# Altium schematic sheet Flasher_2Ch_ISO_Astable.SchDoc
size A
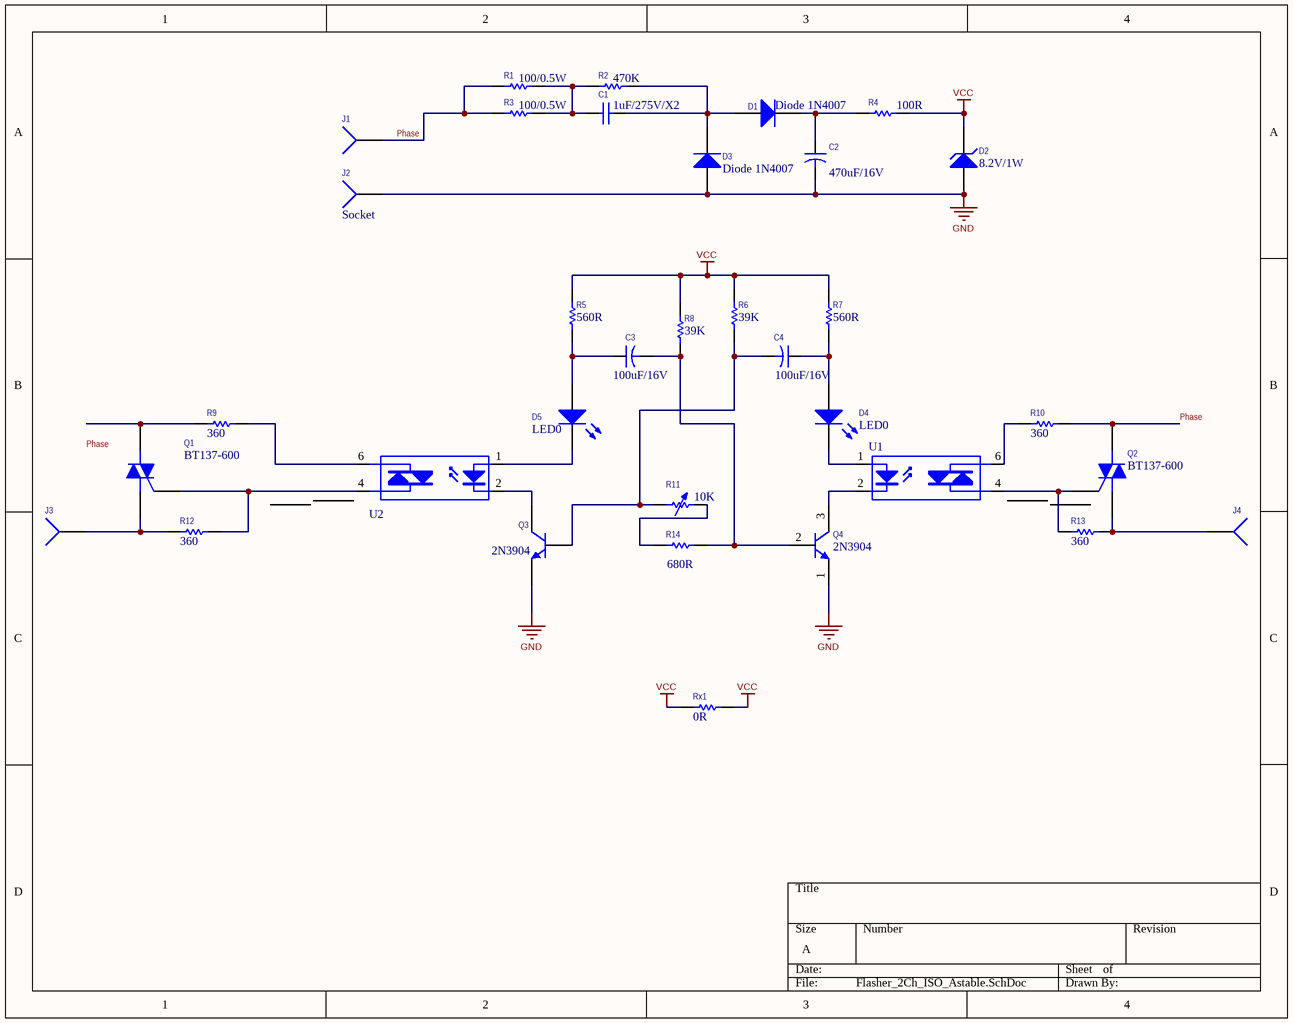
[diagram p0: Flasher_2Ch_ISO_Astable.SchDoc]

## Parts
C1  value 1uF/275V/X2  [Cap_polyester_275V_P22.5]  (hidden comment: Cap)
C2  value 470uF/16V  [Cap electrolitic radial 8x12-3.5]  (hidden comment: Cap2)
C3  value 100uF/16V  [Cap electrolitic radial 5x11-2]  (hidden comment: Cap2)
C4  value 100uF/16V  [Cap electrolitic radial 5x11-2]  (hidden comment: Cap2)
D1  Diode 1N4007  [DO-204AL]
D2  8.2V/1W  [DO-204AL]
D3  Diode 1N4007  [DO-204AL]
D4  LED0  [LED5MM_RED]
D5  LED0  [LED5MM_RED]
J1  Socket  [PIN1]  (value not drawn)
J2  Socket  [PIN1]
J3  Socket  [PIN1]  (value not drawn)
J4  Socket  [PIN1]  (value not drawn)
Q1  BT137-600  [TO-220 AB with heatsink ya25]
Q2  BT137-600  [TO-220 AB with heatsink ya25]
Q3  2N3904  [TO-92 STR]
Q4  2N3904  [TO-92 STR]
R1  value 100/0.5W  [Axial 0_5W 5_0mm]  (hidden comment: Res1)
R2  value 470K  [Axial 0_25 W, 0_4 IN LEAD PITCH]  (hidden comment: Res1)
R3  value 100/0.5W  [Axial 0_5W 5_0mm]  (hidden comment: Res1)
R4  value 100R  [Axial 0_25 W, 0_4 IN LEAD PITCH]  (hidden comment: Res1)
R5  value 560R  [Axial 0_25 W, 0_4 IN LEAD PITCH]  (hidden comment: Res1)
R6  value 39K  [Axial 0_25 W, 0_4 IN LEAD PITCH]  (hidden comment: Res1)
R7  value 560R  [Axial 0_25 W, 0_4 IN LEAD PITCH]  (hidden comment: Res1)
R8  value 39K  [Axial 0_25 W, 0_4 IN LEAD PITCH]  (hidden comment: Res1)
R9  value 360  [Axial 0_25 W, 0_4 IN LEAD PITCH]  (hidden comment: Res1)
R10  value 360  [Axial 0_25 W, 0_4 IN LEAD PITCH]  (hidden comment: Res1)
R11  value 10K  [AXIAL-0.4]  (hidden comment: Res Adj1)
R12  value 360  [Axial 0_25 W, 0_4 IN LEAD PITCH]  (hidden comment: Res1)
R13  value 360  [Axial 0_25 W, 0_4 IN LEAD PITCH]  (hidden comment: Res1)
R14  value 680R  [Axial 0_25 W, 0_4 IN LEAD PITCH]  (hidden comment: Res1)
Rx1  value 0R  [axial-0.3]  (hidden comment: Res1)
U1  MOC3063  [DIP-6]  (value not drawn)
U2  MOC3063  [DIP-6]  (value not drawn)

## Nets
GND: C2.2 D2.1(A) D3.1(A) J2.1 Q3.1(E) Q4.1(E)
VCC: D2.2(K) R4.1 R5.2 R6.2 R7.2 R8.2 Rx1.1 Rx1.2
Phase: J1.1 Q2.2(M2) R1.1 R3.1 R10.1
NetC1_1: C1.1 R1.2 R2.1 R3.2
NetC1_2: C1.2 D1.1(A) D3.2(K) R2.2
NetC2_1: C2.1 D1.2(K) R4.2
NetC3_1: C3.1 D5.1(A) R5.1
NetC3_2: C3.2 Q4.2(B) R8.1 R14.1
NetC4_1: C4.1 D4.1(A) R7.1
NetC4_2: C4.2 Q3.2(B) R6.1 R11.1
NetD4_2: D4.2(K) U1.1(A)
NetD5_2: D5.2(K) U2.1(A)
NetJ3_1: J3.1 Q1.1(M1) R12.2
NetJ4_1: J4.1 Q2.1(M1) R13.1
NetQ1_2: Q1.2(M2) R9.2
NetQ1_3: Q1.3(G) R12.1 U2.4(A/K)
NetQ2_3: Q2.3(G) R13.2 U1.4(A/K)
NetQ3_3: Q3.3(C) U2.2(K)
NetQ4_3: Q4.3(C) U1.2(K)
NetR9_1: R9.1 U2.6(A/K)
NetR10_2: R10.2 U1.6(A/K)
NetR11_2: R11.2 R14.2

Not connected (* = marked no-connect by the designer): U1 3(NC) 5(NC); U2 3(NC) 5(NC)

## Notes on the sheet
- Labels drawn without touching a wire or pin: Phase

## Library data of the parts
C1 = Cap: Capacitor; Published: 8-Jun-2000; LatestRevisionDate: 17-Jul-2002; LatestRevisionNote: Re-released for DXP Platform.; PackageReference: RAD-0.3; Publisher: Altium Limited; PackageDescription: Radial Cap, Thru-Hole; 2 Leads; 0.3 in Pin Spacing
C2-C4 = Cap2: Capacitor; Published: 23-Sep-2002; PackageReference: CAPR5-4X5; Publisher: Altium Limited; PackageDescription: Capacitor; 2 Leads
D1 D3 = Diode 1N4007: 1 Amp General Purpose Rectifier; Published: 8-Jun-2000; LatestRevisionDate: 17-Jul-2002; LatestRevisionNote: Re-released for DXP Platform.; DatasheetVersion: 1998; PackageVersion: Aug-1999; PackageReference: DO-41; Publisher: Altium Limited; PackageDescription: Diode, Axial; Body 5.2 x 2.7 mm (LxDia. max), Lead Dia. 0.86 mm (max); Code_JEDEC: DO-204-AL; ComponentLink1Description: Manufacturer Link; ComponentLink1URL: http://www.fairchildsemi.com/; ComponentLink2Description: Datasheet; ComponentLink2URL: http://www.fairchildsemi.com/ds/1N%2F1N4001.pdf
D2 = D Zener: Zener Diode; Published: 8-Jun-2000; LatestRevisionDate: 17-Jul-2002; LatestRevisionNote: Re-released for DXP Platform.; PackageReference: DIODE-0.7; Publisher: Altium Limited; PackageDescription: Diode, Thru-Hole; 2 Leads; 0.7 in Pin Spacing
D4 D5 = LED0: Typical INFRARED GaAs LED; Published: 8-Jun-2000; LatestRevisionDate: 08-Jul-2005; LatestRevisionNote: Mech Layer 1 removed.; PackageReference: LED-0; Publisher: Altium Limited; PackageDescription: LED; 2 Leads
Q1 Q2 = Triac: Silicon Bidirectional Triode Thyristor; Note: Pin 2 is electrically connected to Pin 4 (TAB); Published: 29-Sep-2000; LatestRevisionDate: 17-Jul-2002; LatestRevisionNote: Re-released for DXP Platform.; DatasheetVersion: 1999; PackageReference: 369-03; Publisher: Altium Limited; PackageDescription: TO, Thru-Hole, Vertical, Heatsink Mounted; 3 In-Line Leads; Pitch 2.28 mm; ComponentLink1Description: Manufacturer Link; ComponentLink1URL: http://www.motorola.com/
Q3 Q4 = 2N3904: NPN General Purpose Amplifier; Published: 8-Jun-2000; LatestRevisionDate: 15-Jan-2003; LatestRevisionNote: PCB Footprint 'BCY-W3/D4.7' replaced; DatasheetVersion: 1997; PackageVersion: Sep-1998; PackageReference: TO-92A; Publisher: Altium Limited; PackageDescription: TO, Flat Index; 3 In-Line, Axial Leads; Body Dia. 4.5mm; Leads 0.51 x 0.48 mm (max); ComponentLink1Description: Manufacturer Link; ComponentLink1URL: http://www.fairchildsemi.com/; ComponentLink2Description: Datasheet; ComponentLink2URL: http://www.fairchildsemi.com/ds/2N%2F2N3904.pdf
R1-R10 R12-R14 Rx1 = Res1: Resistor; Published: 8-Jun-2000; LatestRevisionDate: 17-Jul-2002; LatestRevisionNote: Re-released for DXP Platform.; PackageReference: AXIAL-0.3; Publisher: Altium Limited; PackageDescription: Axial Device, Thru-Hole; 2 Leads; 0.3 in Pin Spacing
R11 = Res Adj1: Variable Resistor; Set Position: 0.5; Published: 8-Jun-2000; LatestRevisionDate: 17-Jul-2002; LatestRevisionNote: Re-released for DXP Platform.; PackageReference: AXIAL-0.7; Publisher: Altium Limited; PackageDescription: Axial Device, Thru-Hole; 2 Leads; 0.7 in Pin Spacing
U1 U2 = Opto TRIAC: Opto-Triac; Published: 24-Mar-1999; LatestRevisionDate: 17-Jul-2002; LatestRevisionNote: Re-released for DXP Platform.; PackageReference: NPSIP4A; Publisher: Altium Limited; PackageDescription: SIP; 4 Leads; Body 10 x 11.5 x 7.5 mm (typ); Pitch 2.54 mm
J1-J4 = Socket: LatestRevisionDate: 17-Jul-2002; LatestRevisionNote: Re-released for DXP Platform.; Publisher: Altium Limited